# Altium schematic sheet U_model.SchDoc
size A4; SheetNumber: 3; SheetTotal: 3
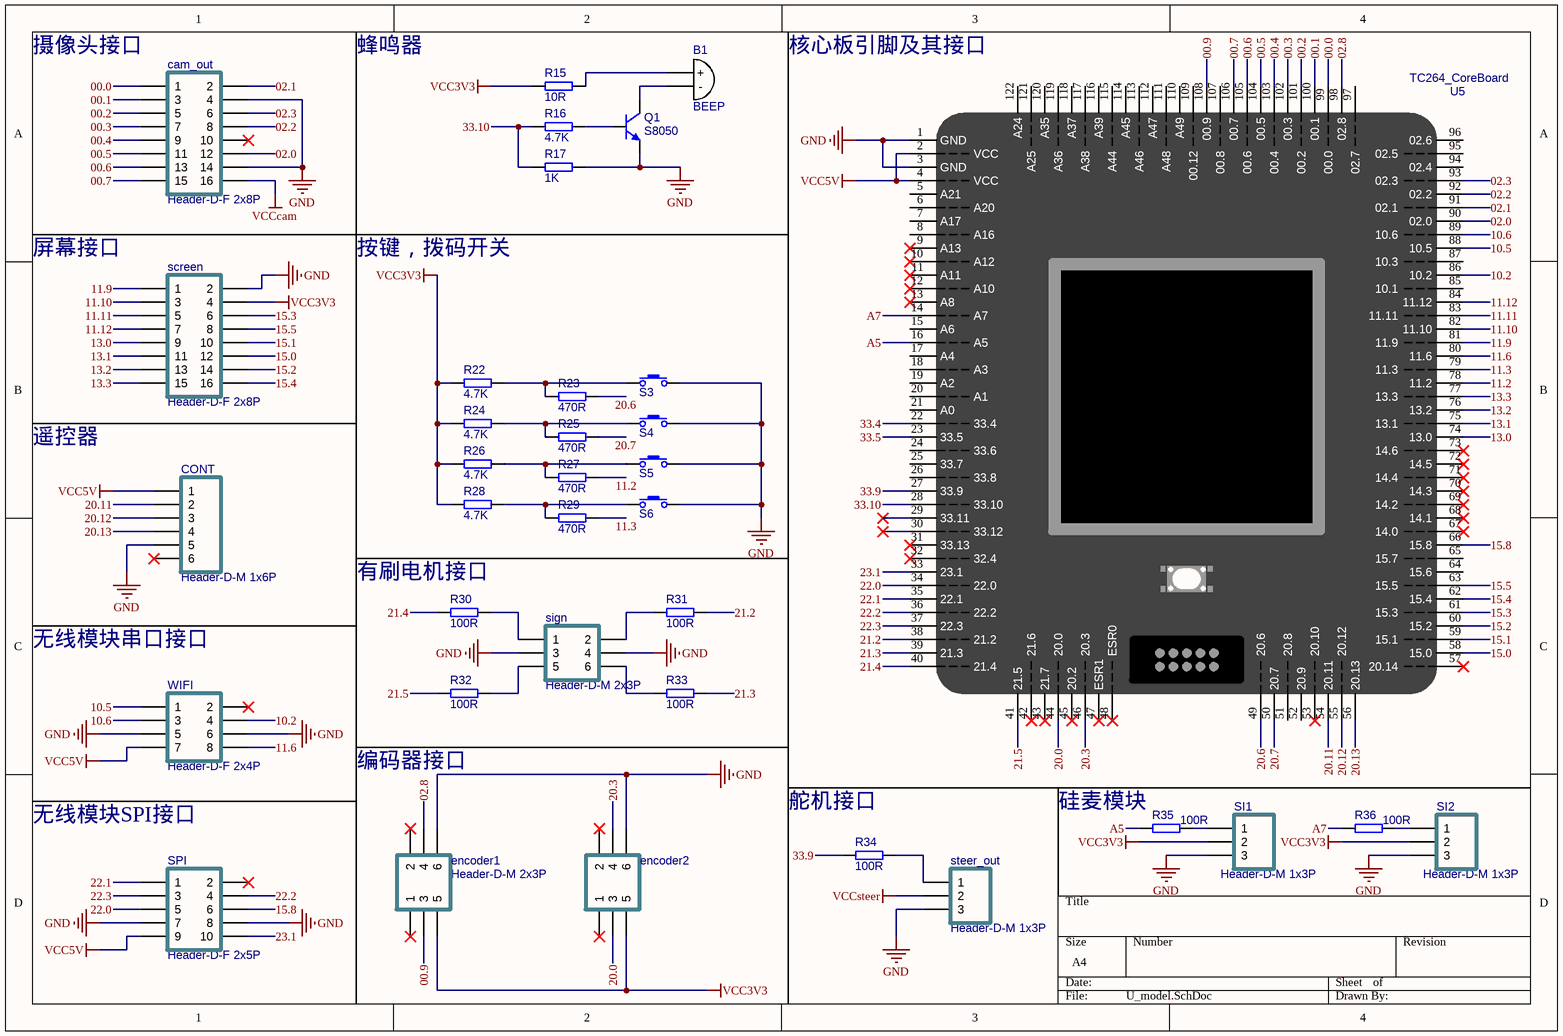
[diagram p0: U_model.SchDoc]

## Parts
B1  BEEP  [BEEP 9x5.5mm]
cam_out  Header-D-F 2x8P  [HDR2X8-F]
CONT  Header-D-M 1x6P  [HDR1X6-M]
encoder1  Header-D-M 2x3P  [HDR2X3-M]
encoder2  (no value)  [HDR2X3-M]
Q1  S8050  [SOT-23]
R15  value 10R  [RESC1608[0603]S-N]  (hidden comment: 10R ±1%)
R16  value 4.7K  [RESC1608[0603]S-N]  (hidden comment: 4.7K ±1%)
R17  value 1K  [RESC1608[0603]S-N]  (hidden comment: 1K ±1%)
R22  value 4.7K  [RESC1608[0603]S-N]  (hidden comment: 4.7K ±1%)
R23  value 470R  [RESC1608[0603]S-N]  (hidden comment: 470R ±1%)
R24  value 4.7K  [RESC1608[0603]S-N]  (hidden comment: 4.7K ±1%)
R25  value 470R  [RESC1608[0603]S-N]  (hidden comment: 470R ±1%)
R26  value 4.7K  [RESC1608[0603]S-N]  (hidden comment: 4.7K ±1%)
R27  value 470R  [RESC1608[0603]S-N]  (hidden comment: 470R ±1%)
R28  value 4.7K  [RESC1608[0603]S-N]  (hidden comment: 4.7K ±1%)
R29  value 470R  [RESC1608[0603]S-N]  (hidden comment: 470R ±1%)
R30  value 100R  [RESC1608[0603]S-N]  (hidden comment: 100R ±1%)
R31  value 100R  [RESC1608[0603]S-N]  (hidden comment: 100R ±1%)
R32  value 100R  [RESC1608[0603]S-N]  (hidden comment: 100R ±1%)
R33  value 100R  [RESC1608[0603]S-N]  (hidden comment: 100R ±1%)
R34  value 100R  [RESC1608[0603]S-N]  (hidden comment: 100R ±1%)
R35  value 100R  [RESC1608[0603]S-N]  (hidden comment: 100R ±1%)
R36  value 100R  [RESC1608[0603]S-N]  (hidden comment: 100R ±1%)
S3  Button  [PTS810-3*4-CurvePin]  (value not drawn)
S4  Button  [PTS810-3*4-CurvePin]  (value not drawn)
S5  Button  [PTS810-3*4-CurvePin]  (value not drawn)
S6  Button  [PTS810-3*4-CurvePin]  (value not drawn)
screen  Header-D-F 2x8P  [HDR2X8-F]
SI1  Header-D-M 1x3P  [HDR1X3-M]
SI2  Header-D-M 1x3P  [HDR1X3-M]
sign  Header-D-M 2x3P  [HDR2X3-M]
SPI  Header-D-F 2x5P  [HDR2X5-F]
steer_out  Header-D-M 1x3P  [HDR1X3-M]
U5  TC264_CoreBoard  [TC264_CoreBoard]
WIFI  Header-D-F 2x4P  [HDR2X4-F]

## Nets
GND: cam_out.4 cam_out.14 CONT.5 encoder1.6 encoder2.6 Q1.2(E) R17.2 S3.1 S4.1 S5.1 S6.1 screen.2 SI1.3 SI2.3 sign.3 sign.4 SPI.7 SPI.8 steer_out.3 U5.1(GND) U5.3(GND) WIFI.5 WIFI.6
VCC3V3: encoder1.5 encoder2.5 R15.1 R22.1 R24.1 R26.1 R28.1 screen.4 SI1.2 SI2.2
VCC5V: CONT.1 SPI.9 U5.2(VCC) U5.4(VCC) WIFI.7
VCCcam: cam_out.16
VCCsteer: steer_out.2
00.0: cam_out.1 U5.99(00.0)
00.1: cam_out.3 U5.100(00.1)
00.2: cam_out.5 U5.101(00.2)
00.3: cam_out.7 U5.102(00.3)
00.4: cam_out.9 U5.103(00.4)
00.5: cam_out.11 U5.104(00.5)
00.6: cam_out.13 U5.105(00.6)
00.7: cam_out.15 U5.106(00.7)
00.9: encoder1.3 U5.108(00.9)
02.0: cam_out.12 U5.90(02.0)
02.1: cam_out.2 U5.91(02.1)
02.2: cam_out.8 U5.92(02.2)
02.3: cam_out.6 U5.93(02.3)
02.8: encoder1.4 U5.98(02.8)
10.2: U5.86(10.2) WIFI.4
10.5: U5.88(10.5) WIFI.1
10.6: U5.89(10.6) WIFI.3
11.2: R27.2 U5.78(11.2)
11.3: R29.2 U5.79(11.3)
11.6: U5.80(11.6) WIFI.8
11.9: screen.1 U5.81(11.9)
11.10: screen.3 U5.82(11.10)
11.11: screen.5 U5.83(11.11)
11.12: screen.7 U5.84(11.12)
13.0: screen.9 U5.74(13.0)
13.1: screen.11 U5.75(13.1)
13.2: screen.13 U5.76(13.2)
13.3: screen.15 U5.77(13.3)
15.0: screen.12 U5.58(15.0)
15.1: screen.10 U5.59(15.1)
15.2: screen.14 U5.60(15.2)
15.3: screen.6 U5.61(15.3)
15.4: screen.16 U5.62(15.4)
15.5: screen.8 U5.63(15.5)
15.8: SPI.6 U5.66(15.8)
20.0: encoder2.3 U5.44(20.0)
20.3: encoder2.4 U5.46(20.3)
20.6: R23.2 U5.49(20.6)
20.7: R25.2 U5.50(20.7)
20.11: CONT.2 U5.54(20.11)
20.12: CONT.3 U5.55(20.12)
20.13: CONT.4 U5.56(20.13)
21.2: R31.2 U5.38(21.2)
21.3: R33.2 U5.39(21.3)
21.4: R30.1 U5.40(21.4)
21.5: R32.1 U5.41(21.5)
22.0: SPI.5 U5.34(22.0)
22.1: SPI.1 U5.35(22.1)
22.2: SPI.4 U5.36(22.2)
22.3: SPI.3 U5.37(22.3)
23.1: SPI.10 U5.33(23.1)
33.4: U5.22(33.4)
33.5: U5.23(33.5)
33.9: R34.1 U5.27(33.9)
33.10: R16.1 R17.1 U5.28(33.10)
A5: R35.1 U5.16(A5)
A7: R36.1 U5.14(A7)
NetB1_1: B1.1(+) R15.2
NetB1_2: B1.2(-) Q1.3(C)
NetQ1_1: Q1.1(B) R16.2
NetR22_2: R22.2 R23.1 S3.2
NetR24_2: R24.2 R25.1 S4.2
NetR26_2: R26.2 R27.1 S5.2
NetR28_2: R28.2 R29.1 S6.2
NetR30_2: R30.2 sign.1
NetR31_1: R31.1 sign.2
NetR32_2: R32.2 sign.5
NetR33_1: R33.1 sign.6
NetR34_2: R34.2 steer_out.1
NetR35_2: R35.2 SI1.1
NetR36_2: R36.2 SI2.1

Not connected (* = marked no-connect by the designer): cam_out 10*; CONT 6*; encoder1 1* 2*; encoder2 1* 2*; SPI 2*; U5 5(A21) 6(A20) 7(A17) 8(A16) 9(A13)* 10(A12)* 11(A11)* 12(A10)* 13(A8)* 15(A6) 17(A4) 18(A3) 19(A2) 20(A1) 21(A0) 24(33.6) 25(33.7) 26(33.8) 29(33.11)* 30(33.12)* 31(33.13)* 32(32.4)* 42(21.6)* 43(21.7)* 45(20.2)* 47(ESR1)* 48(ESR0)* 51(20.8) 52(20.9) 53(20.10)* 57(20.14)* 64(15.6) 65(15.7) 67(14.0)* 68(14.1)* 69(14.2)* 70(14.3)* 71(14.4)* 72(14.5)* 73(14.6)* 85(10.1) 87(10.3) 94(02.4) 95(02.5) 96(02.6) 97(02.7) 107(00.8) 109(00.12) 110(A49) 111(A48) 112(A47) 113(A46) 114(A45) 115(A44) 116(A39) 117(A38) 118(A37) 119(A36) 120(A35) 121(A25) 122(A24); WIFI 2*

## Notes on the sheet
- 摄像头接口
- 蜂鸣器
- 核心板引脚及其接口
- 屏幕接口
- 按键，拨码开关
- 遥控器
- (near R30) 有刷电机接口
- 无线模块串口接口
- 编码器接口
- 无线模块SPI接口
- (near R34) 舵机接口
- (near R35) 硅麦模块

## Library data of the parts
B1 = BEEP: 蜂鸣器
cam_out screen = Header-D-F 2x8P: 2x8pin, 直插, 双排座; Revision: V1.0; Value: Header-D-F 2x8P
CONT = Header-D-M 1x6P: 1x6pin, 直插, 排针; Revision: V1.0; Value: Header-D-M 1x6P
encoder1 encoder2 sign = Header-D-M 2x3P: 2x3pin, 直插, 双排针; Revision: V1.0
  encoder1 sign: Value: Header-D-M 2x3P
Q1 = NPN S8050: NPN 三极管; Published: 8-Jun-2000; Revision: July-2002: Re-released for DXP Platform.; Publisher: Altium Limited; Price(RMB): 0.000; PartNumber: S8050
R15 = Res-Chip_10: 贴片电阻; Power: 1/8W; Revision: V1.0; Tolerance: ±1%
R16 R22 R24 R26 R28 = Res-Chip_3: 贴片电阻; Power: 1/8W; Revision: V1.0; Tolerance: ±1%
R17 = Res-Chip_11: 贴片电阻; Power: 1/8W; Revision: V1.0; Tolerance: ±1%
R23 R25 R27 R29 = Res-Chip_12: 贴片电阻; Power: 1/8W; Revision: V1.0; Tolerance: ±1%
R30-R36 = Res-Chip_9: 贴片电阻; Power: 1/8W; Revision: V1.0; Tolerance: ±1%
S3-S6 = KEY: 按键; Published: 24-Mar-1999; Publisher: Altium Limited; Price(RMB): 0.000
SI1 SI2 steer_out = Header-D-M 1x3P: 1x3pin, 直插, 排针; Revision: V1.0; Value: Header-D-M 1x3P
SPI = Header-D-F 2x5P: 2x5pin, 直插, 双排座; Revision: V1.0; Value: Header-D-F 2x5P
U5 = TC264_CoreBoard: 逐飞科技TC264核心板
WIFI = Header-D-F 2x4P: 2x4pin, 直插, 双排座; Revision: V1.0; Value: Header-D-F 2x4P